# Altium schematic sheet SensorArray.SchDoc
size A3; SheetNumber: 1; SheetTotal: 1
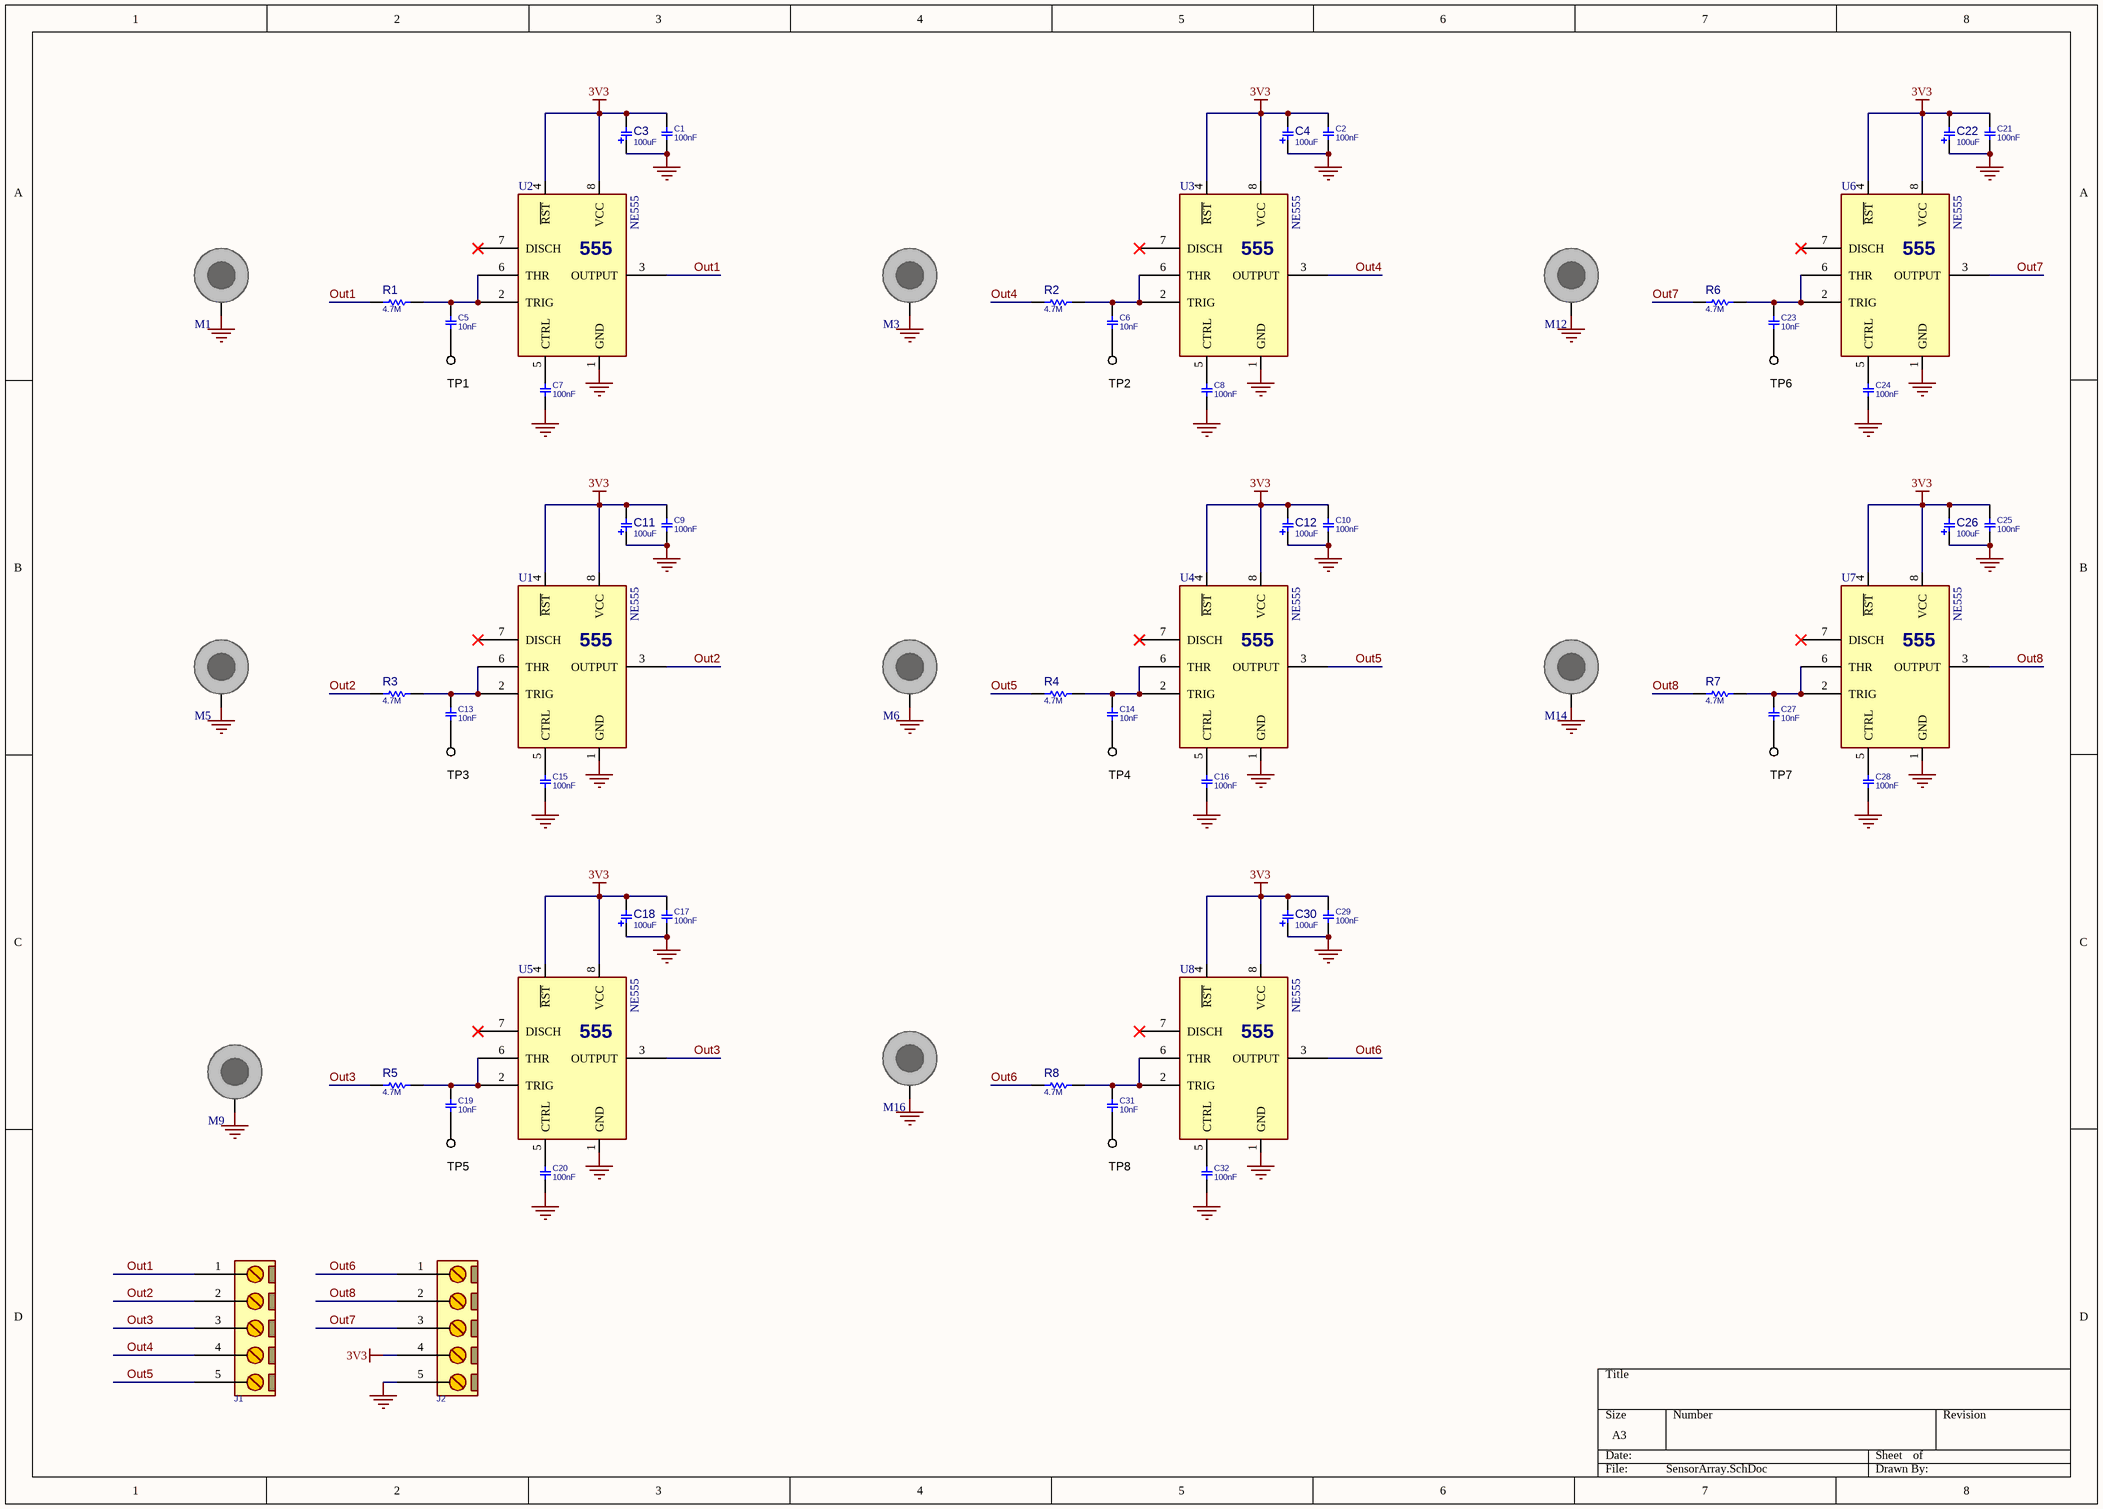
[diagram p0: SensorArray.SchDoc]

## Parts
C1  100nF  [C0805]
C2  100nF  [C0805]
C3  100uF  [C_EL_5]
C4  100uF  [C_EL_5]
C5  10nF  [C0805]
C6  10nF  [C0805]
C7  100nF  [C0805]
C8  100nF  [C0805]
C9  100nF  [C0805]
C10  100nF  [C0805]
C11  100uF  [C_EL_5]
C12  100uF  [C_EL_5]
C13  10nF  [C0805]
C14  10nF  [C0805]
C15  100nF  [C0805]
C16  100nF  [C0805]
C17  100nF  [C0805]
C18  100uF  [C_EL_5]
C19  10nF  [C0805]
C20  100nF  [C0805]
C21  100nF  [C0805]
C22  100uF  [C_EL_5]
C23  10nF  [C0805]
C24  100nF  [C0805]
C25  100nF  [C0805]
C26  100uF  [C_EL_5]
C27  10nF  [C0805]
C28  100nF  [C0805]
C29  100nF  [C0805]
C30  100uF  [C_EL_5]
C31  10nF  [C0805]
C32  100nF  [C0805]
J1  CONN_TB5  [TBG_5]  (value not drawn)
J2  CONN_TB5  [TBG_5]  (value not drawn)
M1  DNP/MH  [SCMH_M3]  (value not drawn)  (no BOM)
M3  DNP/MH  [SCMH_M3]  (value not drawn)  (no BOM)
M5  DNP/MH  [SCMH_M3]  (value not drawn)  (no BOM)
M6  DNP/MH  [SCMH_M3]  (value not drawn)  (no BOM)
M9  DNP/MH  [SCMH_M3]  (value not drawn)  (no BOM)
M12  DNP/MH  [SCMH_M3]  (value not drawn)  (no BOM)
M14  DNP/MH  [SCMH_M3]  (value not drawn)  (no BOM)
M16  DNP/MH  [SCMH_M3]  (value not drawn)  (no BOM)
R1  4.7M  [R0805]
R2  4.7M  [R0805]
R3  4.7M  [R0805]
R4  4.7M  [R0805]
R5  4.7M  [R0805]
R6  4.7M  [R0805]
R7  4.7M  [R0805]
R8  4.7M  [R0805]
TP1  TESTPOINT_SMD  [TPSMD_S1]  (value not drawn)  (no BOM)
TP2  TESTPOINT_SMD  [TPSMD_S1]  (value not drawn)  (no BOM)
TP3  TESTPOINT_SMD  [TPSMD_S1]  (value not drawn)  (no BOM)
TP4  TESTPOINT_SMD  [TPSMD_S1]  (value not drawn)  (no BOM)
TP5  TESTPOINT_SMD  [TPSMD_S1]  (value not drawn)  (no BOM)
TP6  TESTPOINT_SMD  [TPSMD_S1]  (value not drawn)  (no BOM)
TP7  TESTPOINT_SMD  [TPSMD_S1]  (value not drawn)  (no BOM)
TP8  TESTPOINT_SMD  [TPSMD_S1]  (value not drawn)  (no BOM)
U1  NE555  [DIP_8]
U2  NE555  [DIP_8]
U3  NE555  [DIP_8]
U4  NE555  [DIP_8]
U5  NE555  [DIP_8]
U6  NE555  [DIP_8]
U7  NE555  [DIP_8]
U8  NE555  [DIP_8]

## Nets
3V3: C1.2 C2.2 C3.2 C4.2 C9.2 C10.2 C11.2 C12.2 C17.2 C18.2 C21.2 C22.2 C25.2 C26.2 C29.2 C30.2 J2.4 U1.4(~{RST}) U1.8(VCC) U2.4(~{RST}) U2.8(VCC) U3.4(~{RST}) U3.8(VCC) U4.4(~{RST}) U4.8(VCC) U5.4(~{RST}) U5.8(VCC) U6.4(~{RST}) U6.8(VCC) U7.4(~{RST}) U7.8(VCC) U8.4(~{RST}) U8.8(VCC)
GND: C1.1 C2.1 C3.1 C4.1 C7.1 C8.1 C9.1 C10.1 C11.1 C12.1 C15.1 C16.1 C17.1 C18.1 C20.1 C21.1 C22.1 C24.1 C25.1 C26.1 C28.1 C29.1 C30.1 C32.1 J2.5 M1.1 M3.1 M5.1 M6.1 M9.1 M12.1 M14.1 M16.1 U1.1(GND) U2.1(GND) U3.1(GND) U4.1(GND) U5.1(GND) U6.1(GND) U7.1(GND) U8.1(GND)
Out1: J1.1 R1.1 U2.3(OUTPUT)
Out2: J1.2 R3.1 U1.3(OUTPUT)
Out3: J1.3 R5.1 U5.3(OUTPUT)
Out4: J1.4 R2.1 U3.3(OUTPUT)
Out5: J1.5 R4.1 U4.3(OUTPUT)
Out6: J2.1 R8.1 U8.3(OUTPUT)
Out7: J2.3 R6.1 U6.3(OUTPUT)
Out8: J2.2 R7.1 U7.3(OUTPUT)
NetC5_1: C5.1 TP1.1
NetC5_2: C5.2 R1.2 U2.2(TRIG) U2.6(THR)
NetC6_1: C6.1 TP2.1
NetC6_2: C6.2 R2.2 U3.2(TRIG) U3.6(THR)
NetC7_2: C7.2 U2.5(CTRL)
NetC8_2: C8.2 U3.5(CTRL)
NetC13_1: C13.1 TP3.1
NetC13_2: C13.2 R3.2 U1.2(TRIG) U1.6(THR)
NetC14_1: C14.1 TP4.1
NetC14_2: C14.2 R4.2 U4.2(TRIG) U4.6(THR)
NetC15_2: C15.2 U1.5(CTRL)
NetC16_2: C16.2 U4.5(CTRL)
NetC19_1: C19.1 TP5.1
NetC19_2: C19.2 R5.2 U5.2(TRIG) U5.6(THR)
NetC20_2: C20.2 U5.5(CTRL)
NetC23_1: C23.1 TP6.1
NetC23_2: C23.2 R6.2 U6.2(TRIG) U6.6(THR)
NetC24_2: C24.2 U6.5(CTRL)
NetC27_1: C27.1 TP7.1
NetC27_2: C27.2 R7.2 U7.2(TRIG) U7.6(THR)
NetC28_2: C28.2 U7.5(CTRL)
NetC31_1: C31.1 TP8.1
NetC31_2: C31.2 R8.2 U8.2(TRIG) U8.6(THR)
NetC32_2: C32.2 U8.5(CTRL)

Not connected (* = marked no-connect by the designer): U1 7(DISCH)*; U2 7(DISCH)*; U3 7(DISCH)*; U4 7(DISCH)*; U5 7(DISCH)*; U6 7(DISCH)*; U7 7(DISCH)*; U8 7(DISCH)*

## Notes on the sheet
- (in symbol NE555_SOP8) 555

## Library data of the parts
C1 C2 C5-C10 C13-C17 C19-C21 C23-C25 C27-C29 C31 C32 = CAP_SMD_MLCC_0805: CAP, MLCC, -F, -V, MATERIAL, -%, 0201; PARAM: -, -%; MANF_P#: MANF_PART#; PRICE: 100= 1$; MANF: -; PARAM2: -V; ASSEMBLY: ASSEMBLY
  C1 C2 C7-C10 C15-C17 C20 C21 C24 C25 C28 C29 C32: VALUE: 100nF
  C5 C6 C13 C14 C19 C23 C27 C31: VALUE: 10nF
C3 C4 C11 C12 C18 C22 C26 C30 = CAP_SMD_EL: CAP, THD, ELEC,; MANF_P#: MANF_PART#; PARAM2: -V; DESC: DESCRIPTION; DIST#: MOUSER; PARAM: 20%; PRICE: 10= -$; MANF: MANF; ASSEMBLY: ASSEMBLY; VALUE: 100uF
J1 J2 = CONN_TB5: CONN, TERMINAL BLOCK, 5.08mm pitch; VALUE: CONN_TB5
M1 M3 M5 M6 M9 M12 M14 M16 = SCMH_M3: SCREW mouting, M3, 3.0mm diameter and 6.0mm PanHead; ASSEMBLY: DNP; VALUE: DNP/MH
R1-R8 = RES_SMD: RESISTOR, SMD; PARAM: -W; DESC: DESCRIPTION; DIST#: MOUSER; PARAM2: 1%; MANF_P#: -; MANF: -; ASSEMBLY: ASSEMBLY; PRICE: 100= 0.5$; VALUE: 4.7M
TP1-TP8 = TESTPOINT_SMD: TEST POINT; MANF: MANF; MANF_P#: MANF_P#; VALUE: VALUE
U1-U8 = NE555_SOP8: 555 Timer, General-Purpose Single Bipolar Timer; MANF_P#: NE555DR,; MANF: Texas Instruments; PARAM2: 4.5~16V; PARAM: 200mA output, 0~70oC; VALUE: NE555